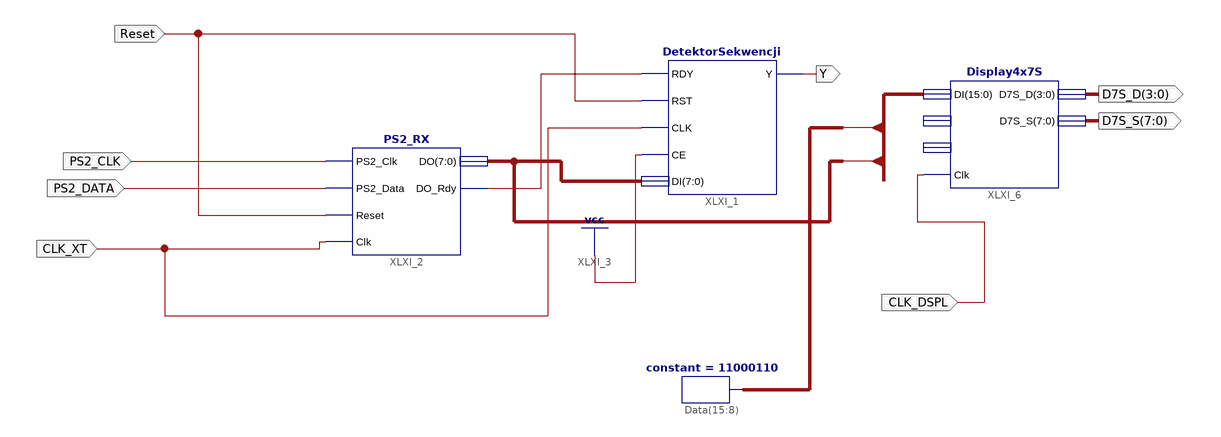
[diagram p0: schematic sheet 1]
// Xilinx ISE schematic DetektorSchemat.sch (xc9500xl) as structural Verilog: 4 symbols, 8 ports
module DetektorSchemat (
  input  Reset,
  input  PS2_CLK,
  input  PS2_DATA,
  input  CLK_XT,
  input  CLK_DSPL,
  output Y,
  output [3:0] D7S_D,
  output [7:0] D7S_S
);

  wire XLXN_10;
  wire [15:0] DI;

  DetektorSekwencji XLXI_1 (.RDY(XLXN_10), .RST(Reset), .CLK(CLK_XT), .CE(1'b1), .DI(DI[7:0]), .Y(Y));
  PS2_RX XLXI_2 (.PS2_Clk(PS2_CLK), .PS2_Data(PS2_DATA), .Clk(CLK_XT), .Reset(Reset), .DO_Rdy(XLXN_10), .DO(DI[7:0]));
  Display4x7S XLXI_6 (.DI(DI), .D7S_D(D7S_D), .D7S_S(D7S_S), .Clk(CLK_DSPL));  // open: DP, Blank
  constant #(.CValue("11000110")) Data[15:8] (.O(DI[15:8]));
endmodule
